# EAGLE schematic user_interface (EAGLE 7.3.0)
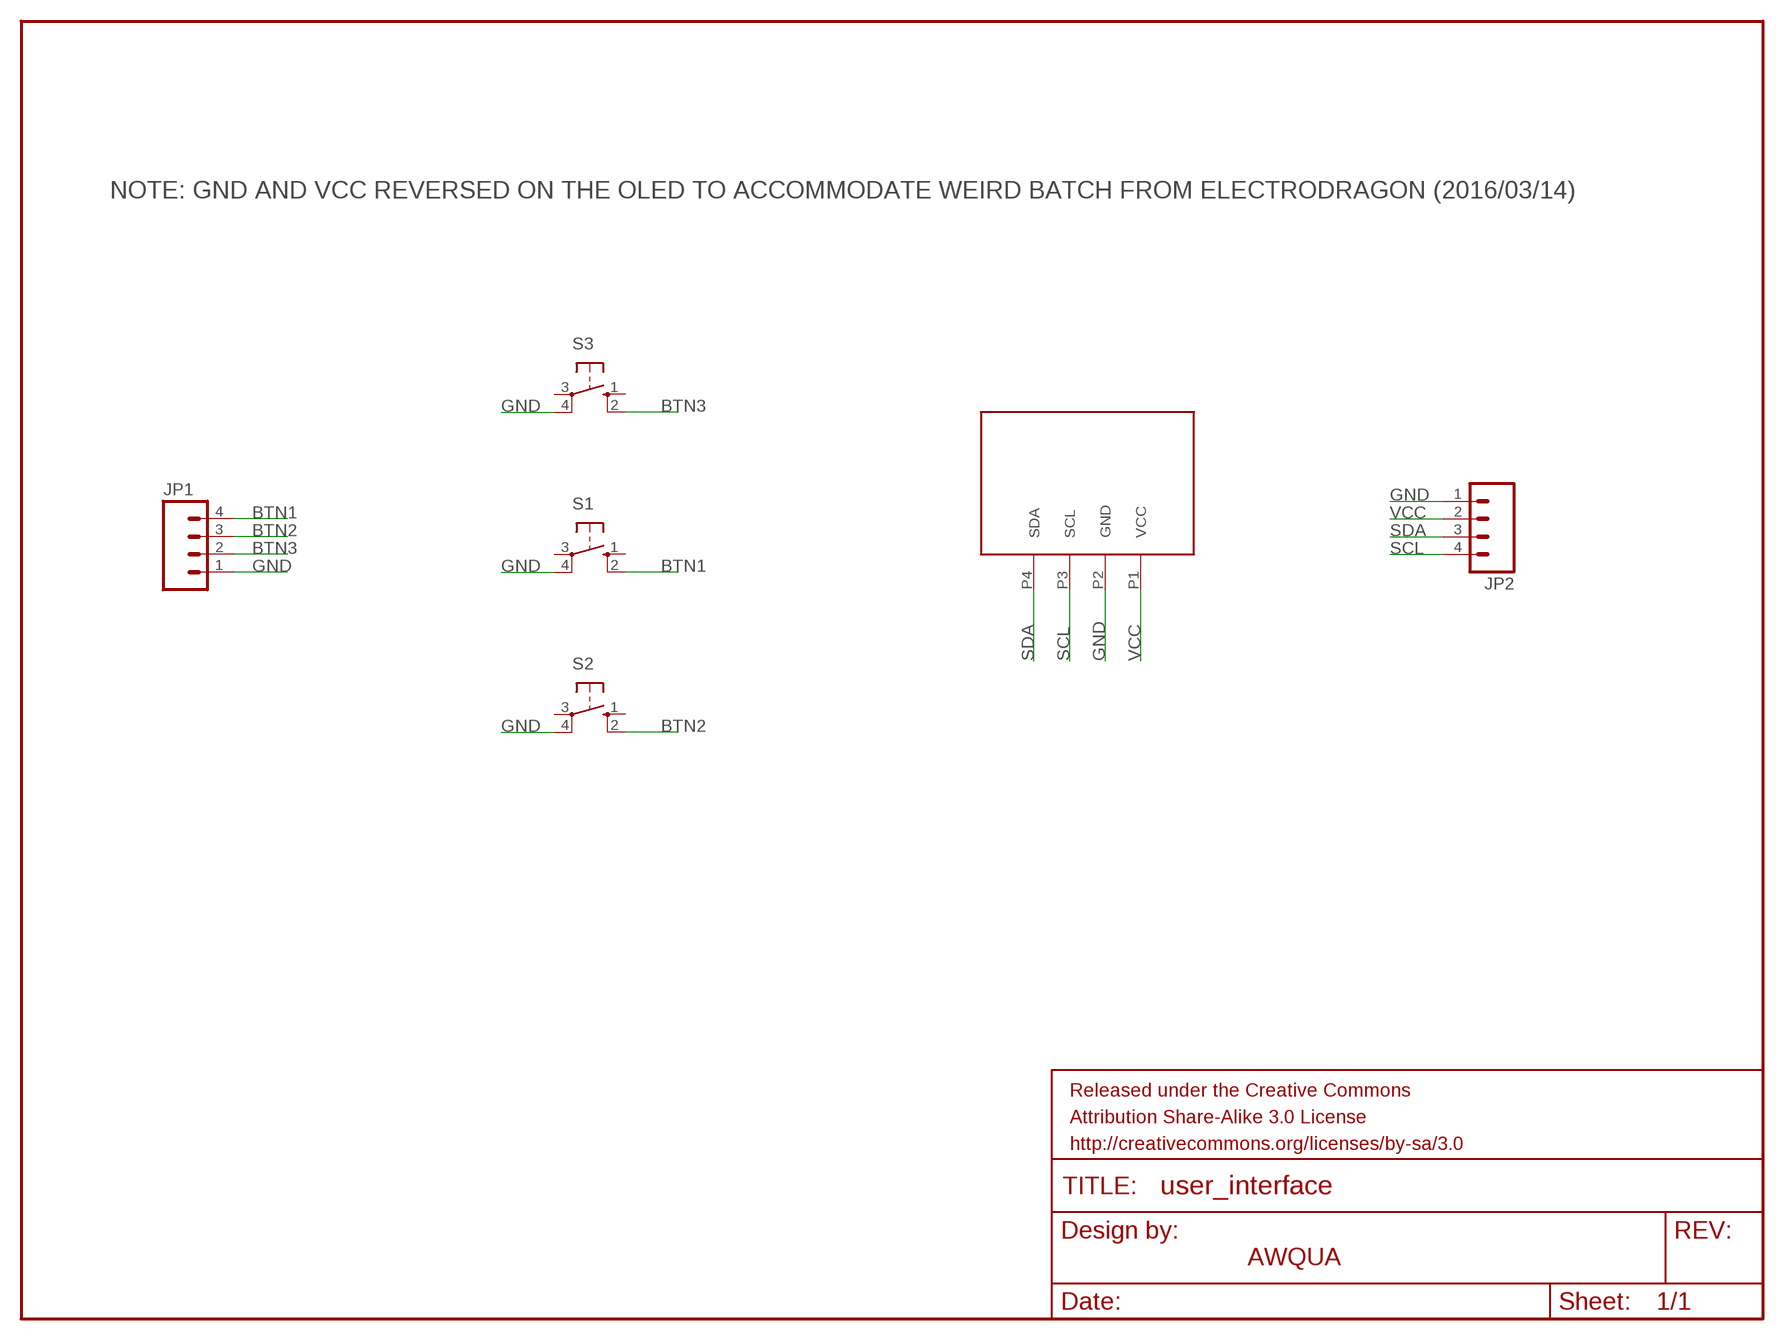
[diagram p0: schematic, sheet 1]

## Parts
FRAME1  FRAME-LETTER  [CREATIVE_COMMONS]
JP1  M04PTH  [1X04]
JP2  M04PTH  [1X04]
S1  40-XX  [B3F-40XX]
S2  40-XX  [B3F-40XX]
S3  40-XX  [B3F-40XX]
U$2  I2C-OLED-096  [I2C-OLED-096]

## Nets
BTN1: JP1.4 S1.2(S1)
BTN2: JP1.3 S2.2(S1)
BTN3: JP1.2 S3.2(S1)
GND: JP1.1 JP2.1 S1.4(P1) S2.4(P1) S3.4(P1) U$2.P2(GND)
SCL: JP2.4 U$2.P3(SCL)
SDA: JP2.3 U$2.P4(SDA)
VCC: JP2.2 U$2.P1(VCC)
Unconnected: S1.1(S) S1.3(P) S2.1(S) S2.3(P) S3.1(S) S3.3(P)

## Notes on the sheet
- NOTE: GND AND VCC REVERSED ON THE OLED TO ACCOMMODATE WEIRD BATCH FROM ELECTRODRAGON (2016/03/14)
- AWQUA

## Library data of the parts
FRAME1 = SparkFun-Aesthetics:FRAME-LETTER: Schematic Frame Standard 8.5x11 US Letter frame
JP1 JP2 = SparkFun-Connectors:M04: Header 4 Standard 4-pin 0.1" header. Use with straight break away headers (SKU : PRT-00116), right angle break away headers (PRT-00553), swiss pins (PRT-00743), machine pins (PRT-00117), and female headers (PRT-00115). Molex polarized connector foot print use with SKU : PRT-08231 with associated crimp pins and housings. 1MM SMD Version SKU: PRT-10208
S1-S3 = adafruit:40-XX: OMRON SWITCH; MF: OMRON COMPONENTS USA; MPN: B3F-4000; OC_FARNELL: 176434; OC_NEWARK: 36K3105
U$2 = awqua_eagle_library:I2C-OLED-096